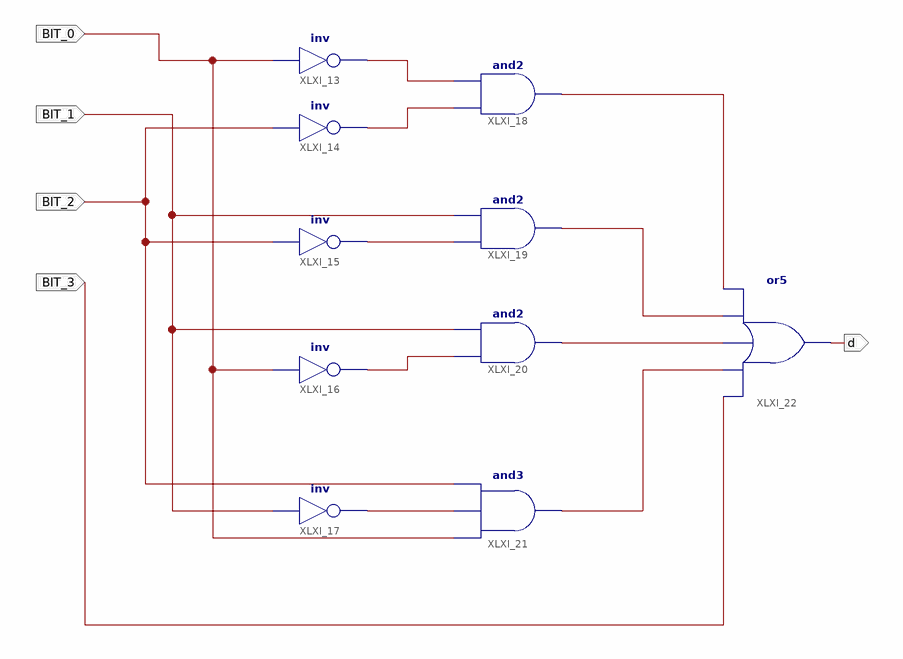
[diagram p0: schematic sheet 1]
// Xilinx ISE schematic SEG_D.sch (spartan6) as structural Verilog: 10 symbols, 5 ports
module SEG_D (
  input  BIT_3,
  input  BIT_0,
  input  BIT_1,
  input  BIT_2,
  output d
);

  wire XLXN_25, XLXN_26, XLXN_27, XLXN_28, XLXN_29, XLXN_30, XLXN_31, XLXN_32, XLXN_33;

  not XLXI_13 (XLXN_25, BIT_0);
  not XLXI_14 (XLXN_26, BIT_2);
  not XLXI_15 (XLXN_27, BIT_2);
  not XLXI_16 (XLXN_28, BIT_0);
  not XLXI_17 (XLXN_29, BIT_1);
  and XLXI_18 (XLXN_33, XLXN_26, XLXN_25);
  and XLXI_19 (XLXN_32, XLXN_27, BIT_1);
  and XLXI_20 (XLXN_31, XLXN_28, BIT_1);
  and XLXI_21 (XLXN_30, BIT_0, XLXN_29, BIT_2);
  or XLXI_22 (d, BIT_3, XLXN_30, XLXN_31, XLXN_32, XLXN_33);
endmodule
